# Altium schematic sheet 6_6_71_6_6_7.schdoc
size 127 x 101 mm
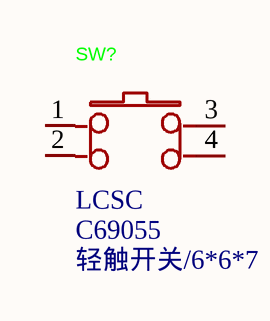
[diagram p0: 6_6_71_6_6_7.schdoc]

## Parts
SW?  Supplier Part: C69055  Supplier: LCSC  [SW-TH_4P-L6.0-W6.0-P4.50-LS6.5]  (hidden comment: 轻触开关/6*6*7)

## Nets

Not connected (* = marked no-connect by the designer): SW? 1 2 3 4

## Library data of the parts
SW? = 轻触开关/6*6*7: Symbol: 6*6*7; Add into BOM: yes; Device: 轻触开关/6*6*7; Manufacturer Part: 轻触开关/6*6*7; LCSC Part Name: 轻触开关，6*6*7塑头，200G，行程0.25mm，直插; Supplier Footprint: 插件; JLCPCB Part Class: Extended Part; Convert to PCB: yes